# EAGLE design optocoupler_3 (EAGLE 9.6.1)
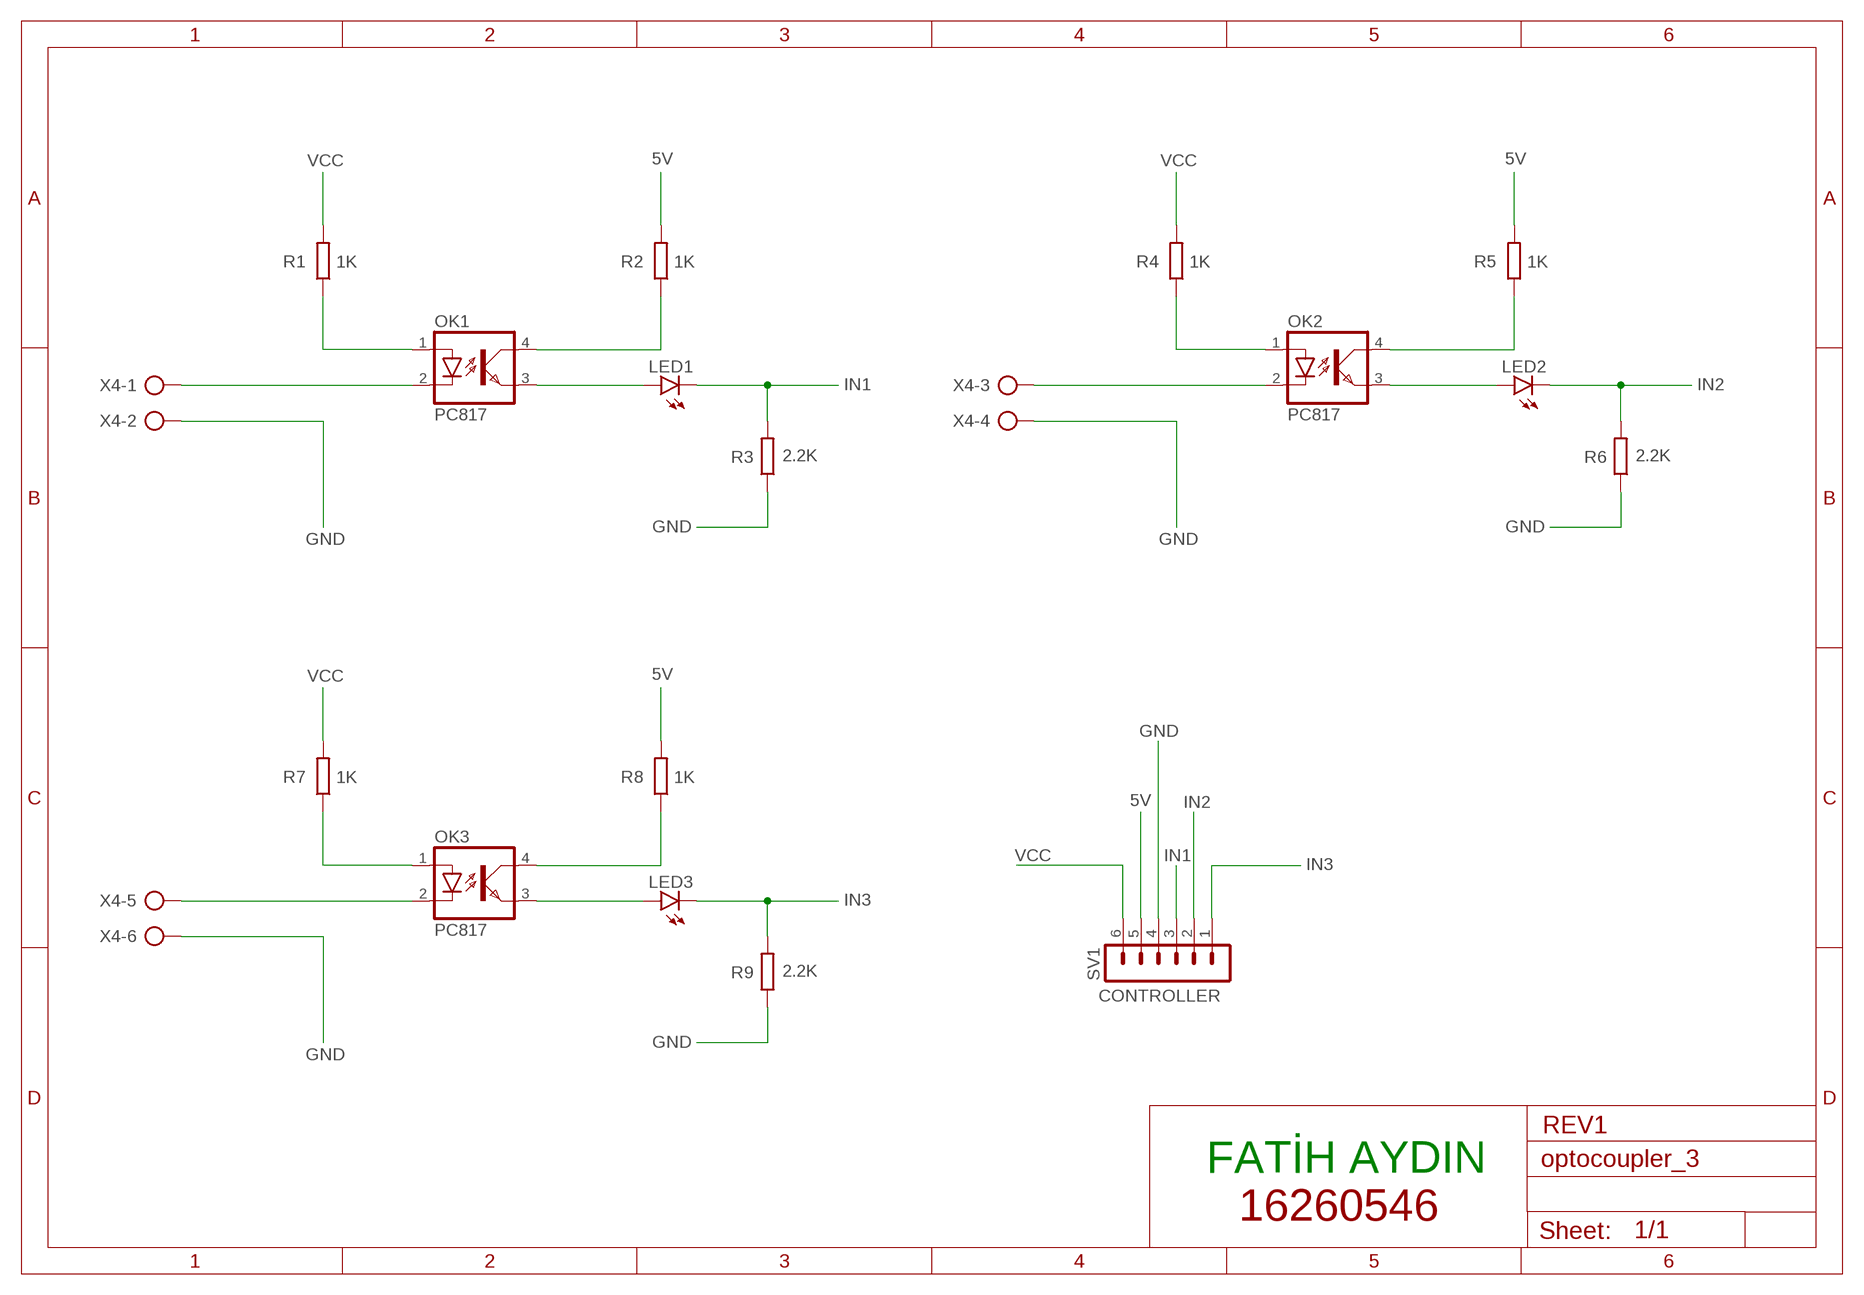
[diagram p0: schematic, sheet 1]

## Parts
LED1  LED5MM  [LED5MM]
LED2  LED5MM  [LED5MM]
LED3  LED5MM  [LED5MM]
OK1  PC817  [DIL04]
OK2  PC817  [DIL04]
OK3  PC817  [DIL04]
R1  1K  R-EU_0204/7  [0204/7]
R2  1K  R-EU_0204/7  [0204/7]
R3  2.2K  R-EU_0204/7  [0204/7]
R4  1K  R-EU_0204/7  [0204/7]
R5  1K  R-EU_0204/7  [0204/7]
R6  2.2K  R-EU_0204/7  [0204/7]
R7  1K  R-EU_0204/7  [0204/7]
R8  1K  R-EU_0204/7  [0204/7]
R9  2.2K  R-EU_0204/7  [0204/7]
SV1  CONTROLLER  MA06-1  [MA06-1]
X4  AK300/6  [AK300/6]

## Nets
5V: R2.2 R5.2 R8.2 SV1.5
GND: R3.1 R6.1 R9.1 SV1.4 X4.2 X4.4 X4.6
IN1: LED1.K(C) R3.2 SV1.3
IN2: LED2.K(C) R6.2 SV1.2
IN3: LED3.K(C) R9.2 SV1.1
N$1: OK1.1(A) R1.1
N$2: OK1.4(COL) R2.1
N$3: OK2.1(A) R4.1
N$4: OK2.4(COL) R5.1
N$5: OK1.2(C) X4.1
N$6: OK2.2(C) X4.3
N$7: LED1.A OK1.3(EMIT)
N$8: LED2.A OK2.3(EMIT)
N$9: OK3.1(A) R7.1
N$10: OK3.4(COL) R8.1
N$11: OK3.2(C) X4.5
N$12: LED3.A OK3.3(EMIT)
VCC: R1.2 R4.2 R7.2 SV1.6

## Notes on the sheet
- REV1
- FATİH AYDIN
- 16260546

## Library data of the parts
LED1-LED3 = led:LED: LED OSRAM: - CHIPLED LG R971, LG N971, LY N971, LG Q971, LY Q971, LO R971, LY R971 LH N974, LH R974 LS Q976, LO Q976, LY Q976 LO Q996 - Hyper CHIPLED LW Q18S LB Q993, LB Q99A, LB R99A - SideLED LS A670, LO A670, LY A670, LG A670, LP A670 LB A673, LV A673, LT A673, LW A673 LH A674 LY A675 LS A676, LA A676, LO A676, LY A676, LW A676 LS A679, LY A679, LG A679 - Hyper Micro SIDELED® LS Y876, LA Y876, LO Y876, LY Y876 LT Y87S - SmartLED LW L88C, LW L88S LB L89C, LB L89S, LG L890 LS L89K, LO L89K, LY L89K LS L896, LA L896, LO L896, LY L896 - TOPLED LS T670, LO T670, LY T670, LG T670, LP T670 LSG T670, LSP T670, LSY T670, LOP T670, LYG T670 LG T671, LOG T671, LSG T671 LB T673, LV T673, LT T673, LW T673 LH T674 LS T676, LA T676, LO T676, LY T676, LB T676, LH T676, LSB T676, LW T676 LB T67C, LV T67C, LT T67C, LS T67K, LO T67K, LY T67K, LW E67C LS E67B, LA E67B, LO E67B, LY E67B, LB E67C, LV E67C, LT E67C LW T67C LS T679, LY T679, LG T679 LS T770, LO T770, LY T770, LG T770, LP T770 LB T773, LV T773, LT T773, LW T773 LH T774 LS E675, LA E675, LY E675, LS T675 LS T776, LA T776, LO T776, LY T776, LB T776 LHGB T686 LT T68C, LB T68C - Hyper Mini TOPLED® LB M676 - Mini TOPLED Santana® LG M470 LS M47K, LO M47K, LY M47K Source: http://www.osram.convergy.de LUXEON: - LUMILED® LXK2-PW12-R00, LXK2-PW12-S00, LXK2-PW14-U00, LXK2-PW14-V00 LXK2-PM12-R00, LXK2-PM12-S00, LXK2-PM14-U00 LXK2-PE12-Q00, LXK2-PE12-R00, LXK2-PE12-S00, LXK2-PE14-T00, LXK2-PE14-U00 LXK2-PB12-K00, LXK2-PB12-L00, LXK2-PB12-M00, LXK2-PB14-N00, LXK2-PB14-P00, LXK2-PB14-Q00 LXK2-PR12-L00, LXK2-PR12-M00, LXK2-PR14-Q00, LXK2-PR14-R00 LXK2-PD12-Q00, LXK2-PD12-R00, LXK2-PD12-S00 LXK2-PH12-R00, LXK2-PH12-S00 LXK2-PL12-P00, LXK2-PL12-Q00, LXK2-PL12-R00 Source: www.luxeon.com KINGBRIGHT: KA-3528ASYC Source: www.kingbright.com
OK1-OK3 = optocoupler:PC817: SHARP OPTO COUPLER; MPN: PC817X4J000F; OC_FARNELL: 9707727; OC_NEWARK: 97K7059
R1-R9 = rcl:R-EU_: RESISTOR, European symbol; SPICEPREFIX: R
SV1 = con-lstb:MA06-1: PIN HEADER; OC_FARNELL: unknown; OC_NEWARK: unknown
X4 = con-ptr500:AK300/6: CONNECTOR; OC_FARNELL: unknown; OC_NEWARK: unknown

## Board
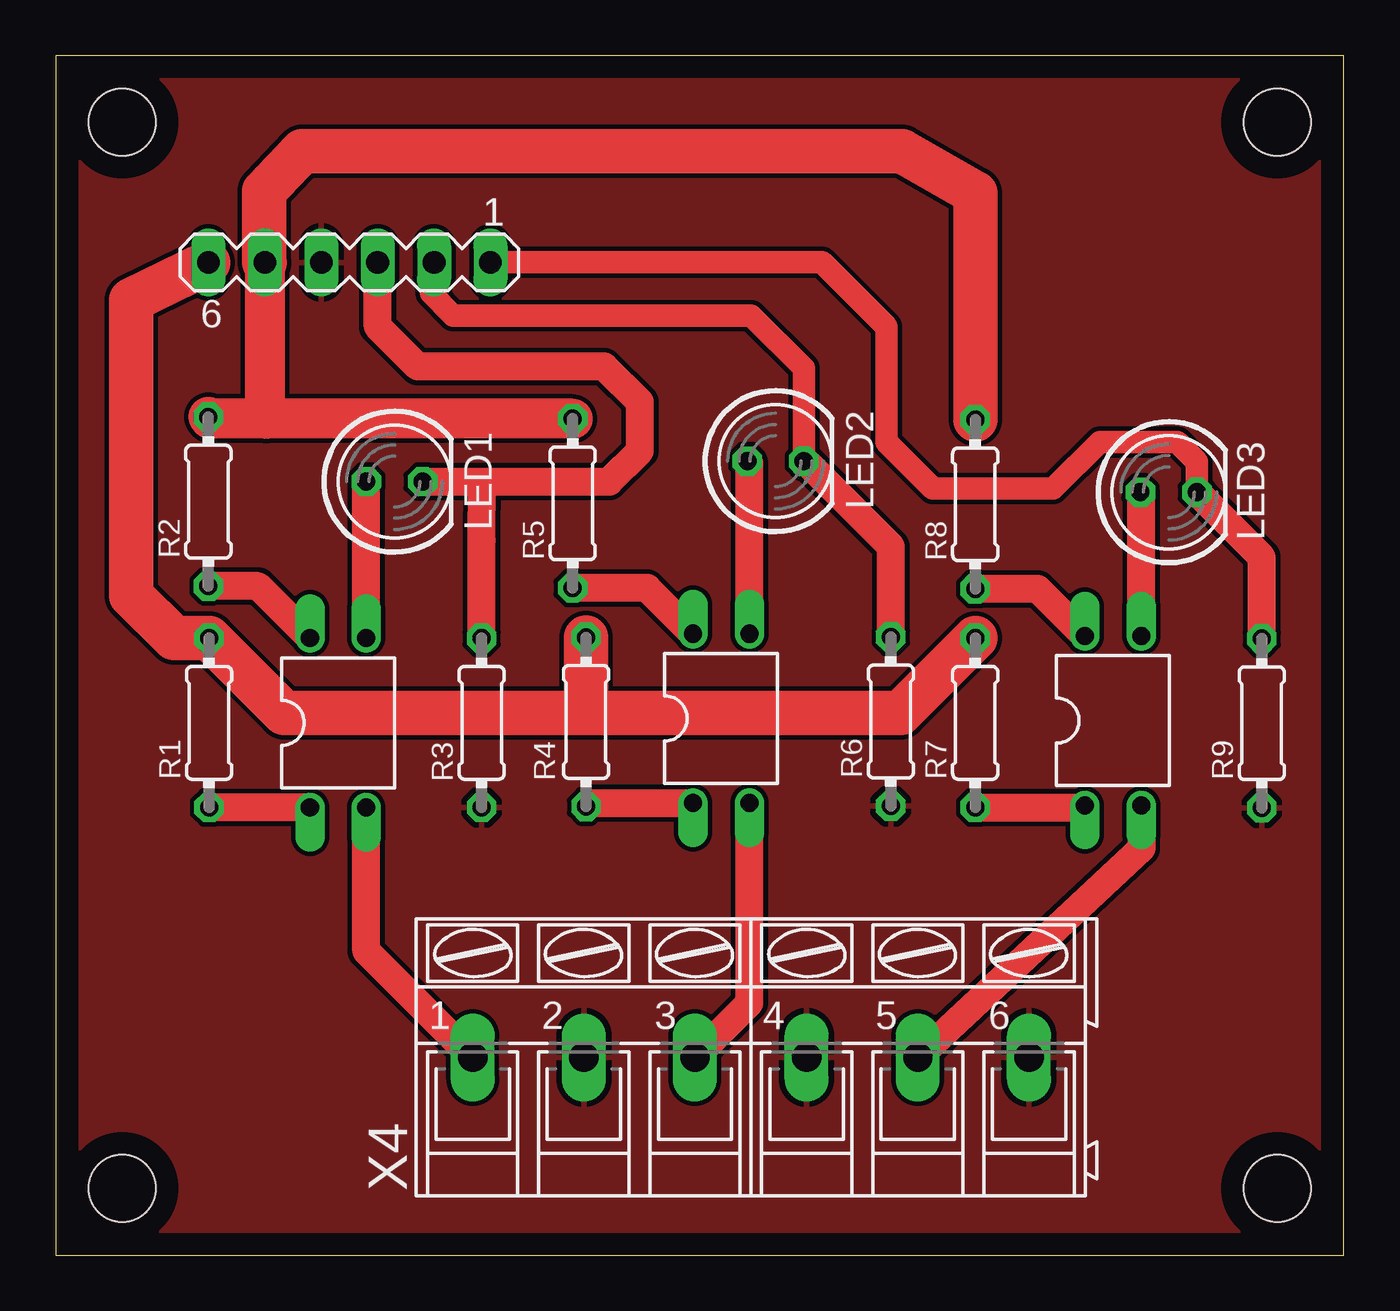
[diagram p1: board, top side]

Size 58 x 54 mm. Coordinates in mm from the lower left corner, seen from the top.
Outline: 0,0 58,0 58,54 0,54 0,0
Copper layers (1*16): Top 0.035mm / dielectric 1.5mm / Bottom 0.035mm
Design rules "PCBway": minimum track width 6mil, minimum drill 0.3mm, track to track 0.205mm, track to pad 0.205mm, pad to pad 0.205mm, via to via 0.205mm, smd to smd 8mil, copper to edge 40mil, drill to drill 8mil, minimum pad ring 10mil, minimum via ring 8mil, stop-mask expansion 4mil, vias tented up to drill 25mil, thermal gap 10mil
Holes 3 mm at 3,51 55,51 55,3 3,3

### Footprints (pad centres in the part's own frame; a part is rotated, then mirrored left to right if it is on the bottom)
LED5MM = drill 0.813 octagon: A -1.27,0; K 1.27,0
DIL04 = drill 0.813 offset: 1 -1.27,-3.81; 2 1.27,-3.81; 3 1.27,3.81; 4 -1.27,3.81
0204/7 = drill 0.813 octagon: 1 -3.81,0; 2 3.81,0
MA06-1 = drill 1.016 long: 1 -6.35,0; 2 -3.81,0; 3 -1.27,0; 4 1.27,0; 5 3.81,0; 6 6.35,0
AK300/6 = drill 1.321 long: 1 -12.522,0; 2 -7.518,0; 3 -2.515,0; 4 2.515,0; 5 7.518,0; 6 12.522,0

### Placement (x,y rotation side)
LED1  15.26,34.82 0 top
LED2  32.41,35.74 0 top
LED3  50.11,34.34 0 top
OK1  12.72,23.96 0 top
OK2  29.96,24.16 0 top
OK3  47.6,24.06 0 top
R1  6.91,23.96 90 top
R2  6.88,33.92 90 top
R3  19.18,23.96 90 top
R4  23.88,24 90 top
R5  23.28,33.84 90 top
R6  37.6,24.02 90 top
R7  41.4,23.96 90 top
R8  41.4,33.8 90 top
R9  54.3,23.94 90 top
SV1  13.23,44.68 180 top
X4  31.3,8.9 0 top

### Tracks (layer width: path | path; a pad name or v marks a point on that pad's centre or on a via)
5V
  Top 1.8: R5.2 9.5,37.65 | 9.5,37.65 6.96,37.65 R2.2 | SV1.5 9.42,37.73 9.5,37.65
  Top 2: R8.2 41.4,47.8 38.1,49.7 11.1,49.7 9.4,47.9 9.4,44.7 SV1.5
GND
  pour Top: 0.1,53.9 0.1,0.1 57.9,0.1 57.9,53.9
IN1
  Top 1.27: R3.2 19.18,32.17 19.2,34.82 | LED1.K 19.2,34.82 | 19.2,34.82 24.92,34.82 26.3,36.2 26.3,38.4 24.7,40 16.3,40 14.5,41.8 SV1.3
IN2
  Top 1.016: LED2.K 33.68,39.92 31.3,42.3 17.9,42.3 16.9,43.3 16.9,44.54 SV1.2
  Top 1.27: R6.2 37.6,31.9 33.76,35.74 LED2.K
IN3
  Top 1.016: LED3.K 51.38,35.72 50.5,36.6 47,36.6 44.9,34.5 39.5,34.5 37.4,36.6 37.4,41.8 34.5,44.7 19.6,44.7 SV1.1
  Top 1.27: R9.2 54.3,31.42 LED3.K
N$1
  Top 1.27: OK1.1 R1.1
N$2
  Top 1.27: OK1.4 9.11,30.11 R2.1
N$3
  Top 1.27: R4.1 24.04,20.35 OK2.1
N$4
  Top 1.27: OK2.4 26.63,30.03 R5.1
N$5
  Top 1.27: X4.1 13.99,13.69 OK1.2
N$6
  Top 1.27: X4.3 31.23,11.35 OK2.2
N$7
  Top 1.27: OK1.3 LED1.A
N$8
  Top 1.27: OK2.3 31.23,35.65 LED2.A
N$9
  Top 1.27: R7.1 46.23,20.15 OK3.1
N$10
  Top 1.27: OK3.4 44.21,29.99 R8.1
N$11
  Top 1.27: OK3.2 48.89,18.31 X4.5
N$12
  Top 1.27: OK3.3 48.87,34.31 LED3.A
VCC
  Top 2: R7.2 38.03,24.4 23.6,24.4 | 23.6,24.4 10.28,24.4 R1.2 5.35,27.77 3.42,29.7 3.42,43 SV1.6 | R4.2 23.88,24.68 23.6,24.4